# Altium schematic sheet EtherCAT.SchDoc
size B
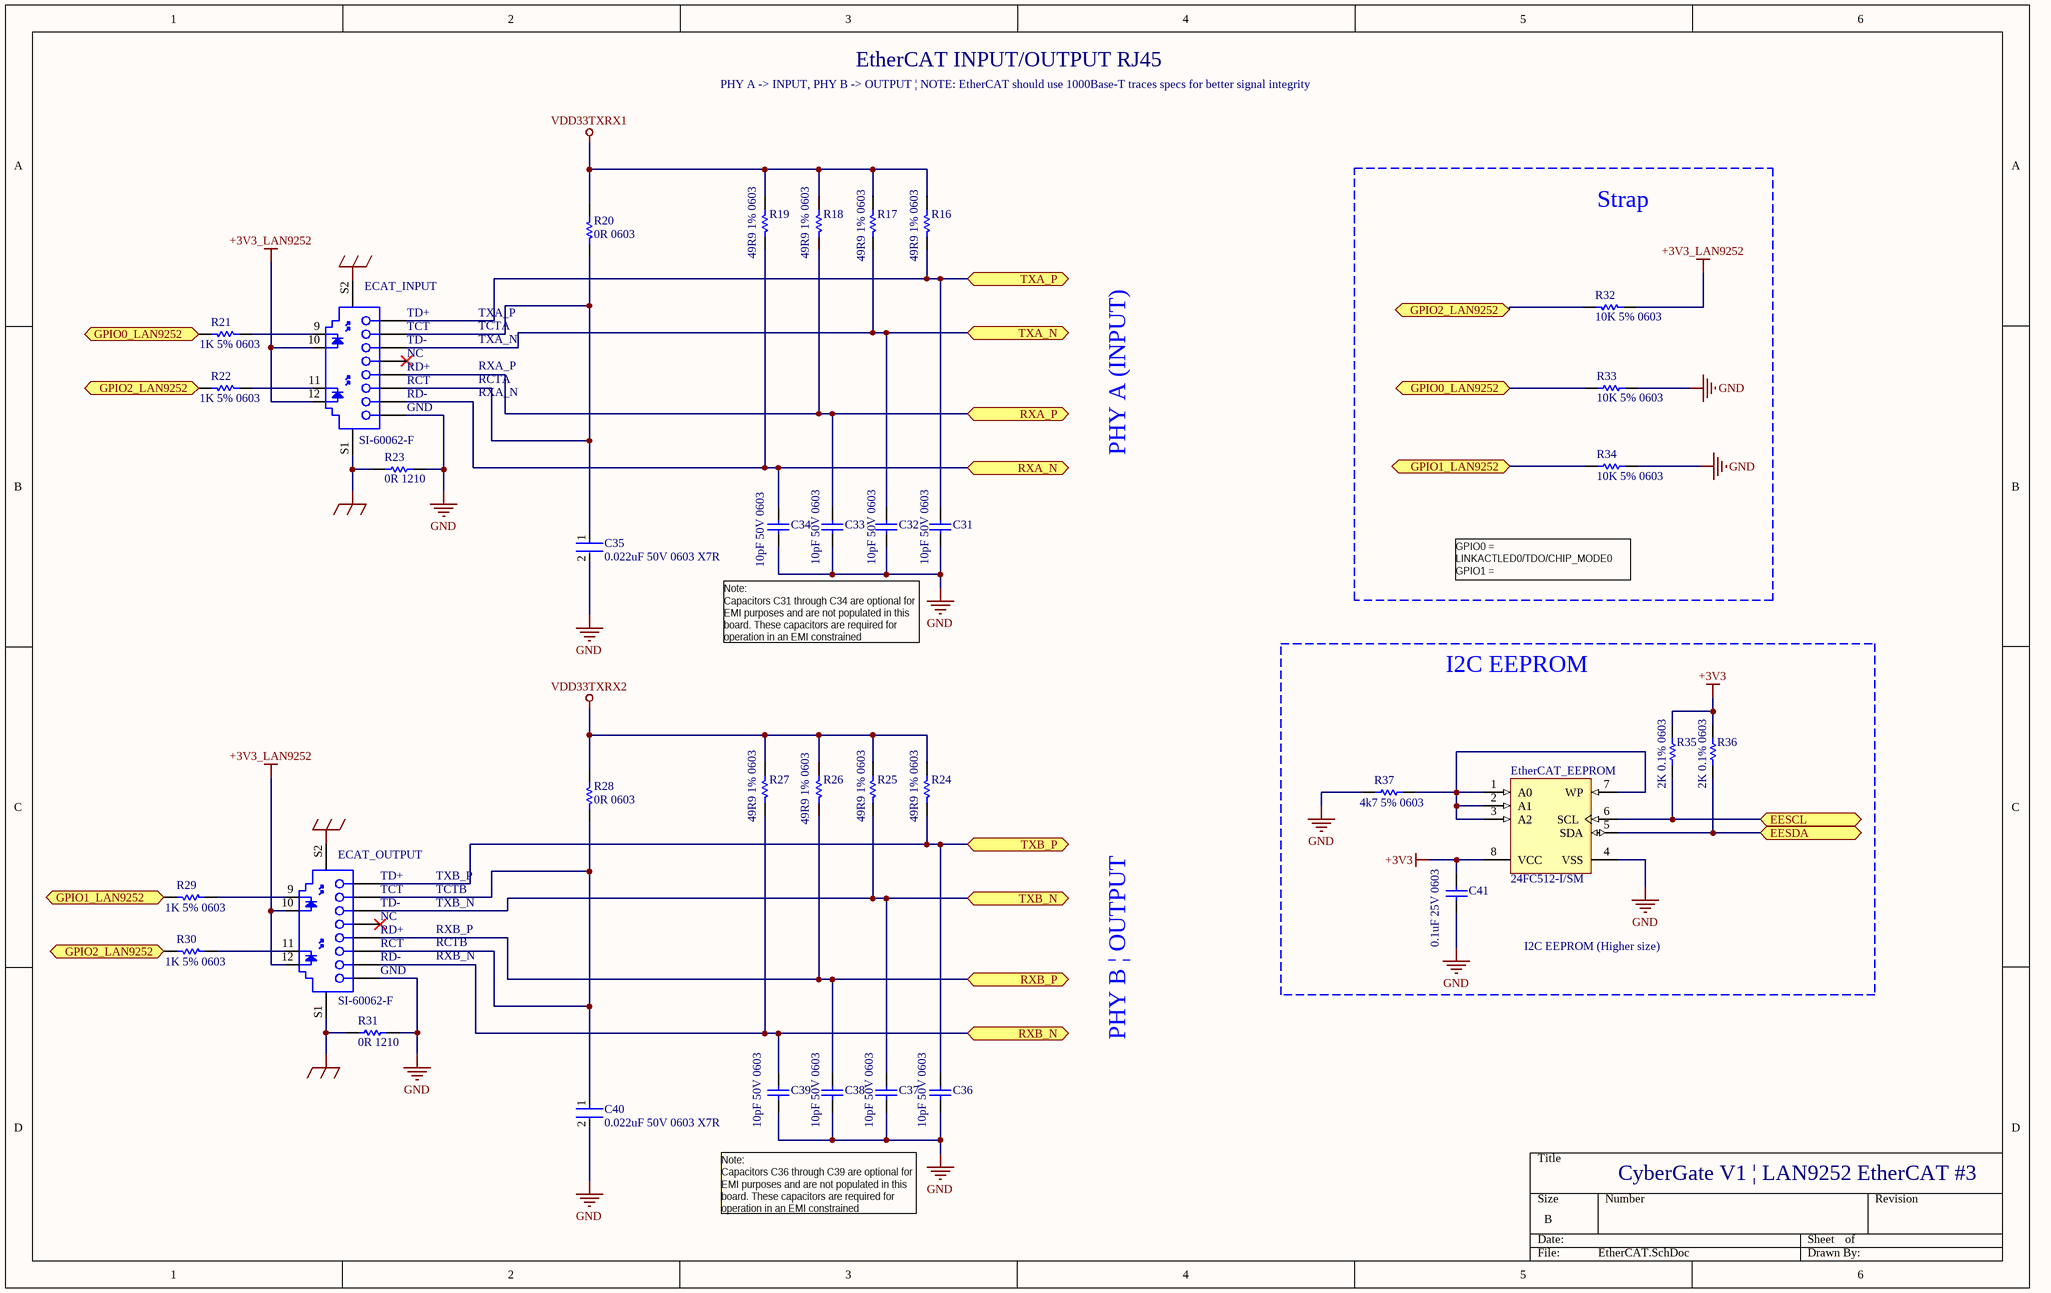
[diagram p0: EtherCAT.SchDoc]

## Parts
C31  10pF 50V 0603  [CAPC1608X90X35LL10T15]
C32  10pF 50V 0603  [CAPC1608X90X35LL10T15]
C33  10pF 50V 0603  [CAPC1608X90X35LL10T15]
C34  10pF 50V 0603  [CAPC1608X90X35LL10T15]
C35  0.022uF 50V 0603 X7R  [FP-C0603C-CF-MFG]
C36  10pF 50V 0603  [CAPC1608X90X35LL10T15]
C37  10pF 50V 0603  [CAPC1608X90X35LL10T15]
C38  10pF 50V 0603  [CAPC1608X90X35LL10T15]
C39  10pF 50V 0603  [CAPC1608X90X35LL10T15]
C40  0.022uF 50V 0603 X7R  [FP-C0603C-CF-MFG]
C41  0.1uF 25V 0603  [CAPC1608X90X35LL10T15]
ECAT_INPUT  SI-60062-F  [BELF-SI-60062-F_V]
ECAT_OUTPUT  SI-60062-F  [BELF-SI-60062-F_V]
EtherCAT_EEPROM  24FC512-I/SM  [SOIJ-SM8_M]
R16  49R9 1% 0603  [RESC1608X55X25NL10T15]
R17  49R9 1% 0603  [RESC1608X55X25NL10T15]
R18  49R9 1% 0603  [RESC1608X55X25NL10T15]
R19  49R9 1% 0603  [RESC1608X55X25NL10T15]
R20  0R 0603  [RESC1608X55X25ML10T15]
R21  1K 5% 0603  [RESC1608X55X25NL10T15]
R22  1K 5% 0603  [RESC1608X55X25NL10T15]
R23  0R 1210  [RESC3225X60X45ML20T20]
R24  49R9 1% 0603  [RESC1608X55X25NL10T15]
R25  49R9 1% 0603  [RESC1608X55X25NL10T15]
R26  49R9 1% 0603  [RESC1608X55X25NL10T15]
R27  49R9 1% 0603  [RESC1608X55X25NL10T15]
R28  0R 0603  [RESC1608X55X25ML10T15]
R29  1K 5% 0603  [RESC1608X55X25NL10T15]
R30  1K 5% 0603  [RESC1608X55X25NL10T15]
R31  0R 1210  [RESC3225X60X45ML20T20]
R32  10K 5% 0603  [RESC1608X55X25ML10T15]
R33  10K 5% 0603  [RESC1608X55X25ML10T15]
R34  10K 5% 0603  [RESC1608X55X25ML10T15]
R35  2K 0.1% 0603  [RESC1608X55X25ML10T15]
R36  2K 0.1% 0603  [RESC1608X55X25ML10T15]
R37  4k7 5% 0603  [RESC1608X55X25ML10T15]

## Blocks framed on the sheet
Strap: R32-R34
I2C EEPROM: C41 EtherCAT_EEPROM R35-R37

## Ports
EESCL (bidir), EESDA (bidir), GPIO0_LAN9252 (bidir), GPIO1_LAN9252 (bidir), GPIO2_LAN9252 (bidir), RXA_N (bidir), RXA_P (bidir), RXB_N (bidir), RXB_P (bidir), TXA_N (bidir), TXA_P (bidir), TXB_N (bidir), TXB_P (bidir)

## Nets
+3V3: C41.2 EtherCAT_EEPROM.8(VCC) R35.2 R36.2
+3V3_LAN9252: ECAT_INPUT.10 ECAT_INPUT.12 ECAT_OUTPUT.10 ECAT_OUTPUT.12 R32.2
Earth2: ECAT_INPUT.S1 ECAT_INPUT.S2 ECAT_OUTPUT.S1 ECAT_OUTPUT.S2 R23.1 R31.1
GND: C31.1 C32.1 C33.1 C34.1 C35.2 C36.1 C37.1 C38.1 C39.1 C40.2 C41.1 ECAT_INPUT.8(GND) ECAT_OUTPUT.8(GND) EtherCAT_EEPROM.4(VSS) R23.2 R31.2 R33.1 R34.1 R37.1
VDD33TXRX1: R16.2 R17.2 R18.2 R19.2 R20.2
VDD33TXRX2: R24.2 R25.2 R26.2 R27.2 R28.2
EESCL: EtherCAT_EEPROM.6(SCL) R35.1 ; port EESCL
EESDA: EtherCAT_EEPROM.5(SDA) R36.1 ; port EESDA
GPIO0_LAN9252: R21.2 R33.2 ; port GPIO0_LAN9252
GPIO1_LAN9252: R29.2 R34.2 ; port GPIO1_LAN9252
GPIO2_LAN9252: R22.2 R30.2 R32.1 ; port GPIO2_LAN9252
RXA_N: C34.2 ECAT_INPUT.7(RD-) R19.1 ; port RXA_N
RXA_P: C33.2 ECAT_INPUT.5(RD+) R18.1 ; port RXA_P
RXB_N: C39.2 ECAT_OUTPUT.7(RD-) R27.1 ; port RXB_N
RXB_P: C38.2 ECAT_OUTPUT.5(RD+) R26.1 ; port RXB_P
TXA_N: C32.2 ECAT_INPUT.3(TD-) R17.1 ; port TXA_N
TXA_P: C31.2 ECAT_INPUT.1(TD+) R16.1 ; port TXA_P
TXB_N: C37.2 ECAT_OUTPUT.3(TD-) R25.1 ; port TXB_N
TXB_P: C36.2 ECAT_OUTPUT.1(TD+) R24.1 ; port TXB_P
NetC35_1: C35.1 ECAT_INPUT.2(TCT) ECAT_INPUT.6(RCT) R20.1
NetC40_1: C40.1 ECAT_OUTPUT.2(TCT) ECAT_OUTPUT.6(RCT) R28.1
NetECAT_INPUT_9: ECAT_INPUT.9 R21.1
NetECAT_INPUT_11: ECAT_INPUT.11 R22.1
NetECAT_OUTPUT_9: ECAT_OUTPUT.9 R29.1
NetECAT_OUTPUT_11: ECAT_OUTPUT.11 R30.1
NetEtherCAT_EEPROM_1: EtherCAT_EEPROM.1(A0) EtherCAT_EEPROM.2(A1) EtherCAT_EEPROM.3(A2) EtherCAT_EEPROM.7(WP) R37.2

Not connected (* = marked no-connect by the designer): ECAT_INPUT 4(NC)*; ECAT_OUTPUT 4(NC)*

## Notes on the sheet
- PHY A -> INPUT, PHY B -> OUTPUT | NOTE: EtherCAT should use 1000Base-T traces specs for better signal integrity
- EtherCAT INPUT/OUTPUT RJ45
- PHY A (INPUT)
- TXA_P
- TCTA
- TXA_N
- RXA_P
- RCTA
- RXA_N
- Note:
  Capacitors C31 through C34 are optional for EMI purposes and are not populated in this  board. These capacitors are required for operation in an EMI constrained environment.
- GPIO0 = LINKACTLED0/TDO/CHIP_MODE0
  GPIO1 = LINKACTLED1/TDI/CHIP_MODE1
  GPIO2 = RUNLED/E2PSIZE
- (near ECAT_OUTPUT) TXB_P
- TCTB
- (near ECAT_OUTPUT) TXB_N
- PHY B | OUTPUT
- (near ECAT_OUTPUT) RXB_P
- RCTB
- RXB_N
- I2C EEPROM (Higher size)
- Note:
  Capacitors C36 through C39 are optional for EMI purposes and are not populated in this  board. These capacitors are required for operation in an EMI constrained environment.
- CyberGate V1 | LAN9252 EtherCAT #3

## Library data of the parts
C31-C34 C36-C39 = CMP-2006-02592-1: Part Number: GRM1885C1H100JA01D; Manufacturer: Murata
C35 C40 = CMP-2006-03879-3: Ceramic Capacitor 0.022Uf 50V, X7R, 10%, 0603, Full Reel; Manufacturer Part Number: C0603C223K5RACTU; Manufacturer: KEMET; Automotive Grade: Grade 1; Capacitance: 22,000 pF; Value: 22,000 pF; Tolerance: 0.1; Temperature Coefficient: 30ppm/°C; Material: Ceramic; Mouser Description: Capacitor; Ceramic; Cap; .022uF; Tol+10%; SMT; Vol-Rtg 50V; X7R; TR; Voltage Rating: 50 V; Category: Cap; Device Class L2: Capacitors; RoHS: TRUE; Package: C0603C-CF; Device Class L1: Passive Components; Temperature Range Low: -55°C; Octopart: https://octopart.com/c0603c223k5ractu-kemet-97352; Temperature: -55°C to +125°C; Temperature Range High: +125°C; Automotive: Yes; Lead Free: Yes; ComponentLink2URL: https://api.kemet.com/component-edge/download/datasheet/C0603C100J5GACAUTO.pdf; Temperature Characteristic: X7R; Height: 0.87mm; Device Class L3: Ceramic Capacitors; Digikey Description: Ceramic Capacitor 0.022Uf 50V, X7R, 10%, 0603, Full Reel; ComponentLink2Description: Datasheet
C41 = CMP-2006-02868-1: Part Number: GRM188R71E104KA01D; Manufacturer: Murata
ECAT_INPUT ECAT_OUTPUT = CMP-2000-07059-1: 1 Port RJ45 Magjack Connector with Yellow and Green LED, 10/100 Base-T, 12-Pin THD, RoHS, Tray; Manufacturer: Bel Fuse; Number of Ways: 8P4C; Gender: Female; Shield Type: STP; Connector Type: RJ45; Contact Plating: Gold; Mounting Type: ThroughHole; Datasheet Version: Rev. B0, 09/2008; Package Reference: SI-60062-F; Manufacturer URL: http://belfuse.com/; Package Description: 12-Pin Through Hole Device, Body 21.59 x 16.13 mm; Series: MagJack; Contact Material: CopperAlloy; Datasheet URL: http://belfuse.com/pdfs/SI-60062-F.pdf; Width: 17.98mm; Length: 15.21mm; Mounting Technology: ThroughHole; Depth: 21.59mm; Orientation: Straight
EtherCAT_EEPROM = CMP-0159-00532-1: 512Kbit, 1MHz, 2.5V, I2C Serial EEPROM, 8-Pin SOIC 208mil, Industrial Temperature; PackageDescription: 8-Lead Plastic Small Outline (SM) - Medium, 5.28 mm Body [SOIJ]; PackageReference: SOIJ-SM8; PackageVersion: revBB, Aug-2009; DatasheetVersion: revJ, Jul-2008
R16-R19 R24-R27 = CMP-1659-00036-1: General Purpose Chip Resistor, 49.9 Ohm, +/- 1%, -55 to 155 degC, 0603 (1608 Metric), RoHS, Tape and Reel; Max Supply Voltage: 3.63 V; Case\Package: LQFP; Interface: SPI; Min Supply Voltage: 2.97 V; PackageReference: 0603; Packaging: Tray; ComponentLink2Description: Datasheet; ComponentLink1Description: Manufacturer URL; ComponentLink2URL: https://datasheet.ciiva.com/11808/0900766b80f96399-11808223.pdf; RoHSCompliant: true; Max Operating Temperature: 85 degC; ComponentLink1URL: http://www.yageo.com/; PackageDescription: 2-Pin Surface Mount Device, Body 1.6 x 0.8 mm; DatasheetVersion: Rev. 4, 04/2009; Min Operating Temperature: -40 degC; Package Quantity: 250; Pins: 48
R20 R28 = CMP-2100-03667-1: Chip Resistor, 0 Ohm, +/- 5%, 0.1 W, -55 to 155 degC, 0603 (1608 Metric), RoHS, Tape and Reel; Manufacturer: Yageo; Temperature Coefficient: 200ppm/degreesC; Voltage Rating: 50V; Power Rating: 100mW; Resistance: 0mOhm; Width: 0.8mm; Max Operating Temperature: 155degC; Tolerance: 5%; Package Reference: 0603; Height: 0.45mm; Depth: 0.8mm; Package Description: 2-Pin Surface Mount Device, Body 1.6 x 0.8 mm; Termination: SMD/SMT; Package Quantity: 5000; Case/Package: 0603; Case Code (Imperial): 0603; Radiation Hardening: No; Number of Pins: 2; Length: 1.6mm; Lead Free: LeadFree; Voltage Rating (DC): 50V; Military Standard: Not; Datasheet URL: http://www.yageo.com/NewPortal/yageodocoutput?fileName=/pdf/R-Chip/PYu-RC_Group_51_RoHS_L_5.pdf; Manufacturer URL: http://www.yageo.com/; Packaging: TapeandReel; Case Code (Metric): 1608; Min Operating Temperature: -55degC; Composition: ThickFilm; RoHSCompliant: true; Contact Plating: Tin; Datasheet Version: Rev. 5, 10/2016; REACH SVHC: NoSVHC
R21 R22 R29 R30 = CMP-1659-00009-4: Chip Resistor, 1 KOhm, +/-1%, 0.1 W, -55 to 155 degC, 0603 (1608 Metric), RoHS, Tape and Reel; Manufacturer: Yageo; Voltage Rating: 50 V; ComponentLink2URL: http://www.yageo.com/documents/recent/PYu-RC_Group_51_RoHS_L_04.pdf; Max Operating Temperature: 155 degC; PackageDescription: 2-Pin Surface Mount Device, Body 1.6 x 0.8 mm; Packaging: Tape and Reel; ComponentLink3Description: Package Specification; REACH SVHC: No SVHC; Mount: Surface Mount; ComponentLink2Description: Datasheet; Length: 1.6 mm; PackageReference: 0603; Height: 0.45 mm; DatasheetVersion: Rev. 4, 02/2016; Min Operating Temperature: -55 degC; ComponentLink1Description: Manufacturer URL; Package Quantity: 200; RoHSCompliant: true; ComponentLink3URL: http://www.farnell.com/datasheets/443971.pdf; Pins: 2; Mounting Technology: Surface Mount; ComponentLink1URL: http://www.yageo.com/
R23 R31 = CMP-2005-00172-1: Part Number: CRCW12100000Z0EAHP; Manufacturer: Vishay Dale
R32-R34 = CMP-2100-03664-1: Chip Resistor, 10 KOhm, +/- 1%, 01 W, -55 to 155 degC, 0603 (1608 Metric), RoHS, Tape and Reel; Manufacturer: Yageo; Temperature Coefficient: 100ppm/degreesC; Resistance: 10KOhm; Voltage Rating: 75V; Power Rating: 100mW; Voltage Rating (DC): 50V; Composition: ThickFilm; RoHSCompliant: true; Height: 0.45mm; Lead Free: LeadFree; Case Code (Metric): 1608; Case/Package: 0603; Datasheet Version: Rev. 5, 10/2016; Package Reference: 0603; Depth: 0.8mm; Package Description: 2-Pin Surface Mount Device, Body 1.6 x 0.8 mm; Case Code (Imperial): 0603; Packaging: TapeandReel; Termination: SMD/SMT; Lead Pitch: 0.3mm; Width: 0.8mm; Number of Pins: 2; Length: 1.6mm; REACH SVHC: NoSVHC; Military Standard: Not; Max Operating Temperature: 155degC; Min Operating Temperature: -55degC; Manufacturer URL: http://www.yageo.com/; Datasheet URL: http://www.yageo.com/NewPortal/yageodocoutput?fileName=/pdf/R-Chip/PYu-RC_Group_51_RoHS_L_5.pdf; Weight: 7.1E-05oz; Tolerance: 1%
R35 R36 = CMP-2000-04430-1: Part Number: RT0603BRD072KL; Manufacturer: Yageo
R37 = CMP-2000-05024-1: Chip Resistor, 4.7 KOhm, +/- 5%, 100 mW, -55 to 155 degC, 0603 (1608 Metric), RoHS, Tape and Reel; Manufacturer: Yageo; Resistance: 4.7kOhms; Temperature Coefficient: 100PPM/C; Power Rating: 100mW; Voltage Rating: 50V; Operating Temperature Range: -55Cto+155C; Case Code - mm: 1608; Tolerance: 5%; Product: ThickFilmResistorsGeneralPurpose; Case Code - in: 0603; Datasheet URL: http://www.yageo.com/documents/recent/PYu-RC_Group_51_RoHS_L_04.pdf; Package Reference: 603; Datasheet Version: Rev. 4, 02/2016; Package Description: 2-Pin Surface Mount Device, Body 1.6 x 0.8 mm; Manufacturer URL: http://www.yageo.com/; Series: RC; Packaging: Reel; Termination Style: SMD/SMT